# EAGLE design Frequency_synthesizer_v1.0 (EAGLE 7.2.0)
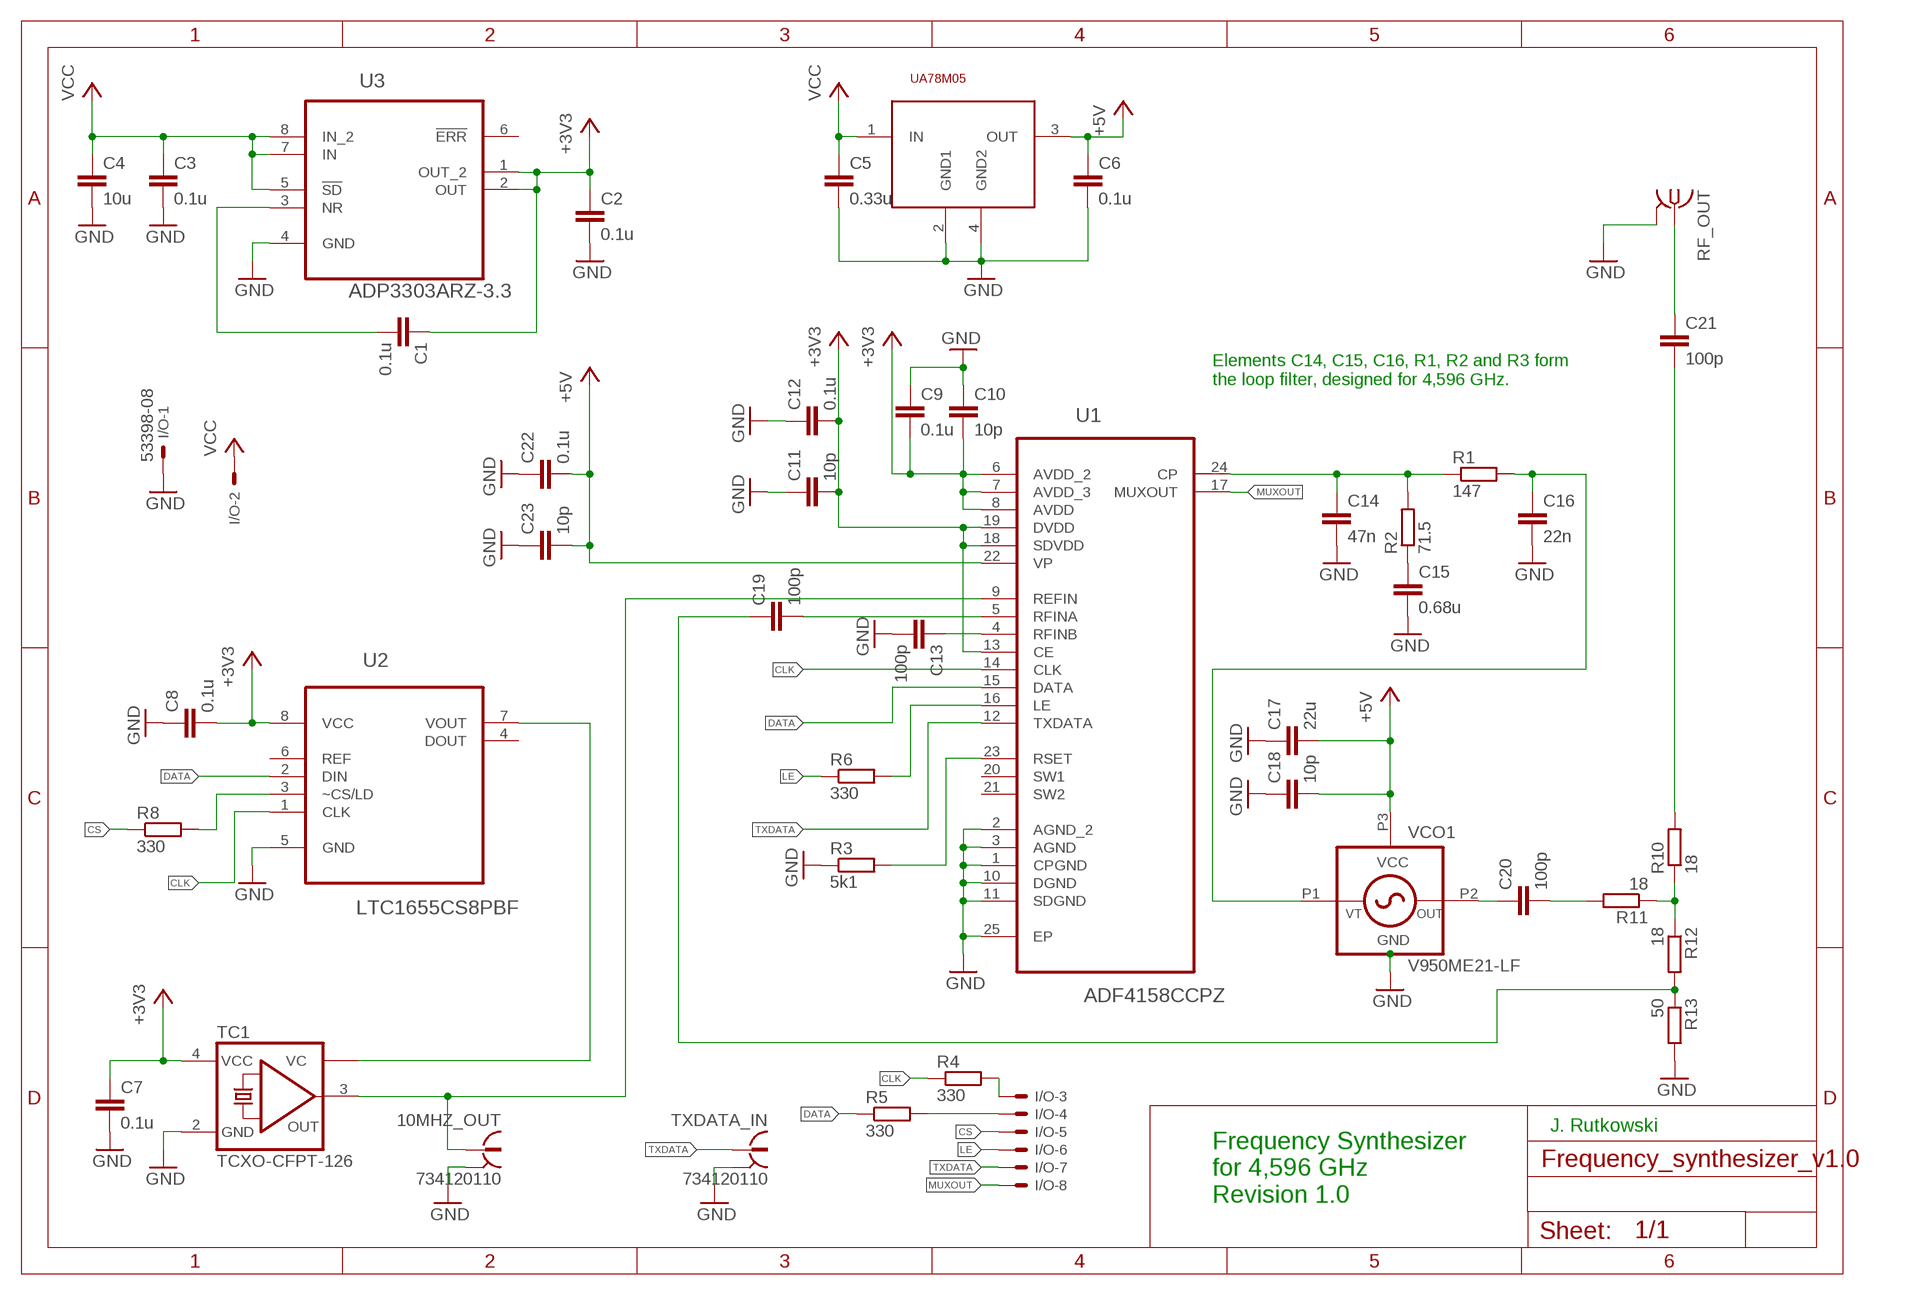
[diagram p0: schematic, sheet 1]

## Parts
10MHZ_OUT  734120110  [734120110]
C1  0.1u  C-EUC0603K  [C0603K]
C2  0.1u  C-EUC0603K  [C0603K]
C3  0.1u  C-EUC0603K  [C0603K]
C4  10u  C-EUC0805K  [C0805K]
C5  0.33u  C-EUC0603K  [C0603K]
C6  0.1u  C-EUC0603K  [C0603K]
C7  0.1u  C-EUC0603K  [C0603K]
C8  0.1u  C-EUC0603K  [C0603K]
C9  0.1u  C-EUC0603K  [C0603K]
C10  10p  C-EUC0603K  [C0603K]
C11  10p  C-EUC0603K  [C0603K]
C12  0.1u  C-EUC0603K  [C0603K]
C13  100p  C-EUC0402  [C0402]
C14  47n  C-EUC0603K  [C0603K]
C15  0.68u  C-EUC0603K  [C0603K]
C16  22n  C-EUC0603K  [C0603K]
C17  22u  C-EUC0805  [C0805]
C18  10p  C-EUC0603K  [C0603K]
C19  100p  C-EUC0402  [C0402]
C20  100p  C-EUC0402  [C0402]
C21  100p  C-EUC0402  [C0402]
C22  0.1u  C-EUC0603K  [C0603K]
C23  10p  C-EUC0603K  [C0603K]
I/O  53398-08  [53398-08]
R1  147  R-EU_R0603  [R0603]
R2  71.5  R-EU_R0603  [R0603]
R3  5k1  R-EU_R0603  [R0603]
R4  330  R-EU_R0603  [R0603]
R5  330  R-EU_R0603  [R0603]
R6  330  R-EU_R0603  [R0603]
R8  330  R-EU_R0603  [R0603]
R10  18  R-EU_R0402  [R0402]
R11  18  R-EU_R0402  [R0402]
R12  18  R-EU_R0402  [R0402]
R13  50  R-EU_R0402  [R0402]
RF_OUT  SMA-142-0711-871/876  [J502-ND-142-0711-871/876]
TC1  TCXO-CFPT-126  [7.0X5.0-4-PAD]
TXDATA_IN  734120110  [734120110]
U1  ADF4158CCPZ  [QFN50P400X400X80-25N]
U2  LTC1655CS8PBF  [SOIC127P600X175-8N]
U3  ADP3303ARZ-3.3  [SOIC127P600X175-8N]
U$1  UA78M05  [SOT-223]
VCO1  V950ME21-LF  MINI-14S  [MINI-14S]

## Nets
+3V3: C1.1 C2.1 C7.1 C8.2 C9.2 C10.2 C11.2 C12.2 TC1.4(VCC) U1.6(AVDD_2) U1.7(AVDD_3) U1.8(AVDD) U1.13(CE) U1.18(SDVDD) U1.19(DVDD) U2.8(VCC) U3.1(OUT_2) U3.2(OUT)
+5V: C6.1 C17.2 C18.2 C22.2 C23.2 U1.22(VP) U$1.3(OUT) VCO1.P3(VCC)
CLK: R4.1 U1.14(CLK) U2.1(CLK)
CS: I/O.5 R8.1
DATA: R5.1 U1.15(DATA) U2.2(DIN)
GND: 10MHZ_OUT.S@1 10MHZ_OUT.S@2 10MHZ_OUT.S@3 C2.2 C3.2 C4.2 C5.2 C6.2 C7.2 C8.1 C9.1 C10.1 C11.1 C12.1 C13.2 C14.2 C15.2 C16.2 C17.1 C18.1 C22.1 C23.1 I/O.1 R3.1 R13.2 RF_OUT.G@1 RF_OUT.G@2 RF_OUT.G@3 RF_OUT.G@4 TC1.2(GND) TXDATA_IN.S@1 TXDATA_IN.S@2 TXDATA_IN.S@3 U1.1(CPGND) U1.2(AGND_2) U1.3(AGND) U1.10(DGND) U1.11(SDGND) U1.25(EP) U2.5(GND) U3.4(GND) U$1.2(GND1) U$1.4(GND2) VCO1.S1 VCO1.S2 VCO1.S3 VCO1.S4 VCO1.S5 VCO1.S6 VCO1.S7 VCO1.S8 VCO1.S9 VCO1.S10 VCO1.S11
LE: I/O.6 R6.1
MUXOUT: I/O.8 U1.17(MUXOUT)
N$1: C14.1 R1.1 R2.2 U1.24(CP)
N$2: C16.1 R1.2 VCO1.P1(VT)
N$3: C1.2 U3.3(NR)
N$4: C15.1 R2.1
N$5: C13.1 U1.4(RFINB)
N$6: R8.2 U2.3(~CS/LD)
N$7: I/O.4 R5.2
N$8: I/O.3 R4.2
N$9: 10MHZ_OUT.1 TC1.3(OUT) U1.9(REFIN)
N$10: TC1.1(VC) U2.7(VOUT)
N$13: R6.2 U1.16(LE)
N$14: R3.2 U1.23(RSET)
N$15: C20.1 VCO1.P2(OUT)
N$16: C20.2 R11.2
N$17: R10.1 R11.1 R12.1
N$18: C19.1 R12.2 R13.1
N$19: C21.2 R10.2
N$20: C21.1 RF_OUT.1
N$21: C19.2 U1.5(RFINA)
TXDATA: I/O.7 TXDATA_IN.1 U1.12(TXDATA)
VCC: C3.1 C4.1 C5.1 I/O.2 U3.5(!SD) U3.7(IN) U3.8(IN_2) U$1.1(IN)
Unconnected: U1.20(SW1) U1.21(SW2) U2.4(DOUT) U2.6(REF) U3.6(!ERR)

## Notes on the sheet
- Elements C14, C15, C16, R1, R2 and R3 form
  the loop filter, designed for 4,596 GHz.
- J. Rutkowski
- Frequency Synthesizer
  for 4,596 GHz
  Revision 1.0

## Library data of the parts
10MHZ_OUT TXDATA_IN = con-coax:734120110: MICRO COAXIAL CONNECTOR RECEPTACLE VERTICAL Source: Data sheet <http://www.molex.com/pdm_docs/sd/734120110_sd.pdf>
C1-C23 = rcl:C-EU: CAPACITOR, European symbol
I/O = con-molex:53?-08: CONNECTOR wire to board 1.25 mm (.049 inch) pitch header; OC_FARNELL: 1125371; OC_NEWARK: unknown
R1-R6 R8 R10-R13 = rcl:R-EU_: RESISTOR, European symbol
RF_OUT = con-coax:SMA-: SMA 50 Ohm End Launch Jack Receptacle - Round Contact Johnson Components Source: www.johnsoncomponents.com .. J502-ND.pdf; MF: JOHNSON COMPONENTS; MPN: 142-0711-871; OC_FARNELL: unknown; OC_NEWARK: 01C1639
TC1 = IQD-Frequency-Products:TCXO: CRYSTAL RESONATOR
U1 = AD_PLL:ADF4158CCPZ: Frequency Synthesizer; MPN: ADF4158CCPZ; OC_FARNELL: -; OC_NEWARK: 76R7557; PACKAGE: LFCSP-24; SUPPLIER: Analog Devices
U2 = LTC_By_element14_Batch_1:LTC1655CS8PBF: 16-Bit Rail-to-Rail Micropower DAC; MPN: LTC1655CS8#PBF; OC_FARNELL: 1663654; OC_NEWARK: 56M2907; PACKAGE: SOIC-8; SUPPLIER: Linear Technology
U3 = analog-devices:ADP3303ARZ-3.3: Linear Regulator; MPN: ADP3303ARZ-3.3; OC_FARNELL: 2305721; OC_NEWARK: 59K2583; PACKAGE: SOIC-8; SUPPLIER: ANALOG DEVICES
U$1 = Custom-parts:UA78M05
VCO1 = z-comm:MINI-14S: VCO

## Board
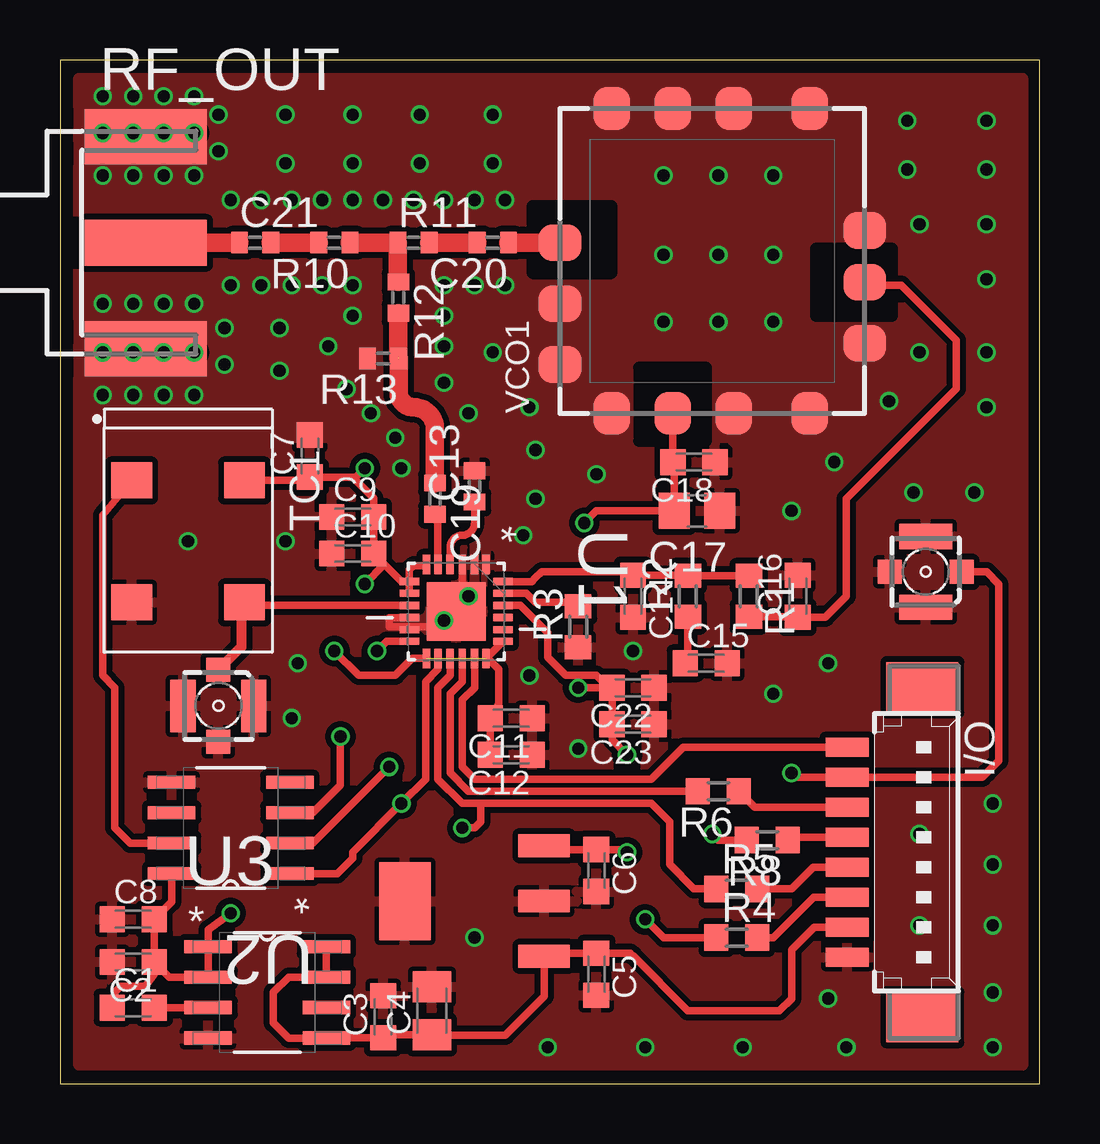
[diagram p1: board, top side]
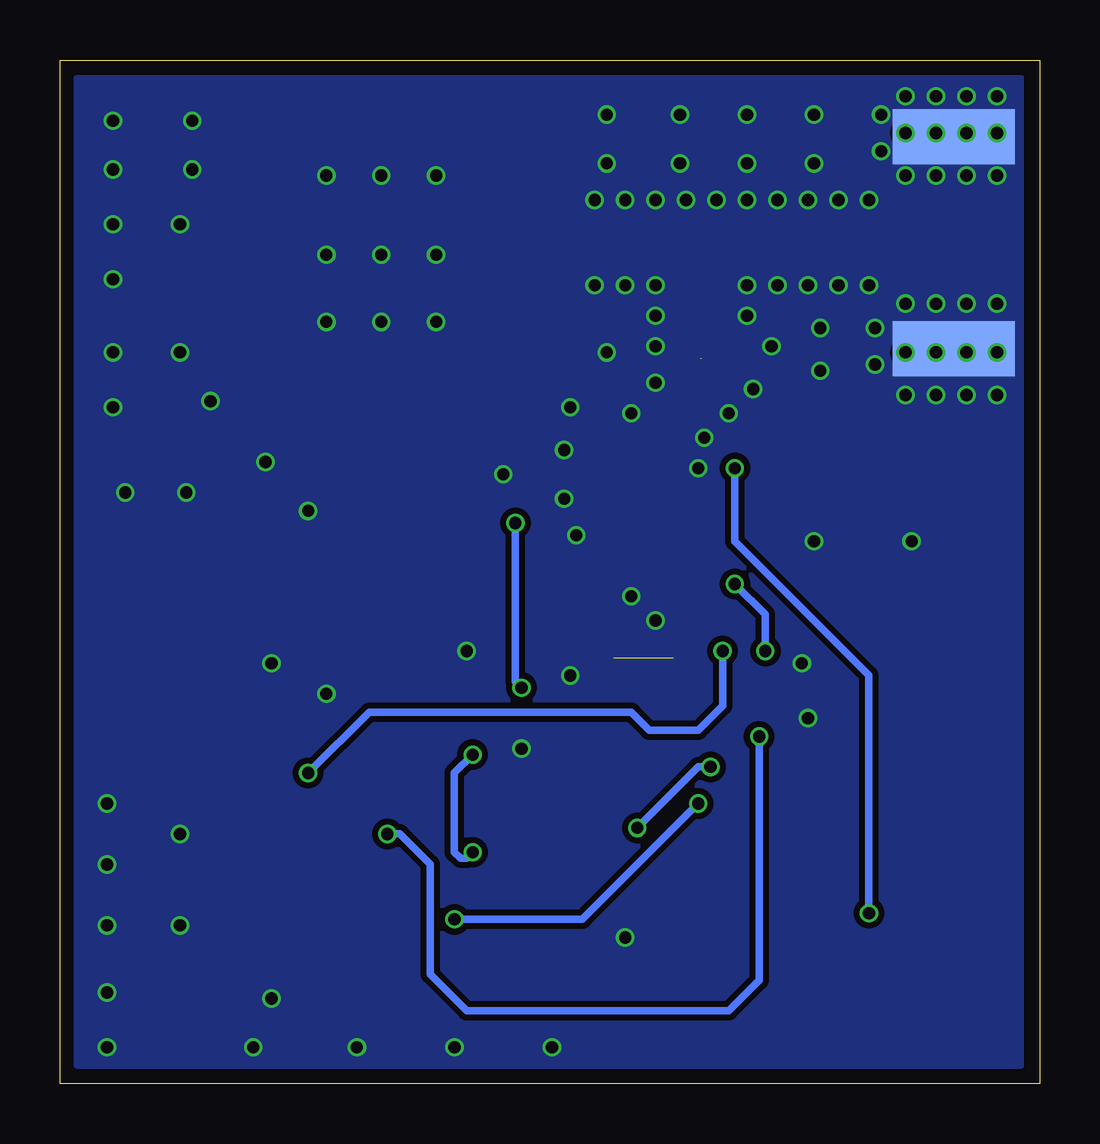
[diagram p2: board, bottom side, seen from below]

Size 40.82 x 42.66 mm. Coordinates in mm from the lower left corner, seen from the top.
Outline: 0,0 40.82,0 40.82,42.66 0,42.66 0,0
Copper layers (1*16): Top 0.018mm / dielectric 1.55mm / Bottom 0.018mm
Design rules "eC_2Layer_PClass6_BaseCopperO18_eCDefault *": minimum track width 0.15mm, minimum drill 0.35mm, track to track 0.15mm, track to pad 0.15mm, pad to pad 0.15mm, via to via 0.15mm, smd to smd 0mil, copper to edge 0.25mm, drill to drill 0.35mm, minimum pad ring 0.175mm, minimum via ring 0.125mm, stop-mask expansion 0mil, vias tented up to drill 0.45mm, thermal gap 0.2mm

### Footprints (pad centres in the part's own frame; a part is rotated, then mirrored left to right if it is on the bottom)
734120110 = smd 1 x 1: 1 0,-1.5; S@1 0,1.5 | smd 1.05 x 2.2: S@2 -1.475,0; S@3 1.475,0
C0603K = smd 1.05 x 1.08: 1 -0.875,0; 2 0.875,0
C0805K = smd 1.3 x 1.6: 1 -1,0; 2 1,0
C0402 = smd 0.7 x 0.9: 1 -0.65,0; 2 0.65,0
C0805 = smd 1.3 x 1.5: 1 -0.95,0; 2 0.95,0
53398-08 = smd 0.8 x 1.8: 1 4.375,-2.5; 2 3.125,-2.5; 3 1.875,-2.5; 4 0.625,-2.5; 5 -0.625,-2.5; 6 -1.875,-2.5; 7 -3.125,-2.5; 8 -4.375,-2.5 | smd 2.1 x 3: S1 6.875,0.625; S2 -6.875,0.625
R0603 = smd 1 x 1.1: 1 -0.85,0; 2 0.85,0
R0402 = smd 0.7 x 0.9: 1 -0.65,0; 2 0.65,0
J502-ND-142-0711-871/876 = smd 5.08 x 1.905: 1 2.565,0 | smd 5.08 x 2.286: G@1 2.565,4.42; G@2 2.565,-4.42 | smd 5.08 x 2.286 bottom: G@3 2.565,4.42; G@4 2.565,-4.42
7.0X5.0-4-PAD = smd 1.5 x 1.7: 1 -2.54,-2.35; 2 2.54,-2.35; 3 2.54,2.35; 4 -2.54,2.35
QFN50P400X400X80-25N = smd 0.813 x 0.305: 1 -1.956,1.245; 2 -1.956,0.762; 3 -1.956,0.254; 4 -1.956,-0.254; 5 -1.956,-0.762; 6 -1.956,-1.245; 13 1.956,-1.245; 14 1.956,-0.762; 15 1.956,-0.254; 16 1.956,0.254; 17 1.956,0.762; 18 1.956,1.245 | smd 0.305 x 0.813: 7 -1.245,-1.956; 8 -0.762,-1.956; 9 -0.254,-1.956; 10 0.254,-1.956; 11 0.762,-1.956; 12 1.245,-1.956; 19 1.245,1.956; 20 0.762,1.956; 21 0.254,1.956; 22 -0.254,1.956; 23 -0.762,1.956; 24 -1.245,1.956 | smd 2.438 x 2.438: 25 0,0
SOIC127P600X175-8N = smd 1.981 x 0.533: 1 -2.464,1.905; 2 -2.464,0.635; 3 -2.464,-0.635; 4 -2.464,-1.905; 5 2.464,-1.905; 6 2.464,-0.635; 7 2.464,0.635; 8 2.464,1.905
SOIC127P600X175-8N' = smd 1.981 x 0.559: 1 -2.464,1.905; 2 -2.464,0.635; 3 -2.464,-0.635; 4 -2.464,-1.905; 5 2.464,-1.905; 6 2.464,-0.635; 7 2.464,0.635; 8 2.464,1.905
SOT-223 = smd 0.95 x 2.15: 1 -2.3,-2.9; 2 0,-2.9; 3 2.3,-2.9 | smd 3.25 x 2.15: 4 0,2.9
MINI-14S = smd 1.524 x 1.778: P1 -0.889,-6.35; P2 0.762,6.35; S1 -3.429,-6.35; S2 1.27,-6.35; S7 -1.778,6.35; S8 -4.318,6.35 | smd 1.778 x 1.524: P3 -6.35,1.651; S3 6.35,-4.064; S4 6.35,-0.889; S5 6.35,1.651; S6 6.35,4.191; S9 -6.35,4.191; S10 -6.35,-0.889; S11 -6.35,-4.064

### Placement (x,y rotation side)
10MHZ_OUT  6.6,15.75 180 top
C1  3.05,3.17 0 top
C2  3.05,5.08 180 top
C3  13.46,2.79 90 top
C4  15.49,3.05 90 top
C5  22.35,4.57 270 top
C6  22.35,8.89 270 top
C7  10.41,26.16 90 top
C8  3.05,6.86 0 top
C9  12.19,23.62 0 top
C10  12.19,22.1 0 top
C11  18.8,15.24 180 top
C12  18.8,13.72 180 top
C13  17.27,24.89 90 top
C14  23.88,20.32 270 top
C15  26.92,17.53 0 top
C16  30.73,20.32 90 top
C17  26.54,23.88 180 top
C18  26.42,25.91 180 top
C19  15.62,24.38 270 top
C20  18.03,35.05 180 top
C21  8.13,35.05 0 top
C22  23.88,16.51 180 top
C23  23.88,14.99 180 top
I/O  35.31,9.65 270 top
R1  28.7,20.32 270 top
R2  26.16,20.32 90 top
R3  21.59,19.05 90 top
R4  28.19,6.1 0 top
R5  28.19,8.13 0 top
R6  27.43,12.19 180 top
R8  29.46,10.16 180 top
R10  11.43,35.05 180 top
R11  14.73,35.05 0 top
R12  14.1,32.77 270 top
R13  13.46,30.23 180 top
RF_OUT  1.02,35.05 0 top
TC1  5.33,22.61 270 top
TXDATA_IN  36.07,21.34 90 top
U1  16.51,19.68 270 top
U2  7.11,10.67 180 top
U3  ADP3303ARZ-3.3  [SOIC127P600X175-8N']  8.64,3.81 0 top
U$1  17.27,7.62 90 top
VCO1  27.18,34.29 90 top

### Tracks (layer width: path | path; a pad name or v marks a point on that pad's centre or on a via)
+3V3  (via drill 0.51)  (1 unrouted)
  Top 0.305: C2.1 4.56,4.45 U3.2 U3.1 6.17,6.43 v7.11,7.11 | C2.1 3.92,5.45 3.94,4.57 3.56,4.06 2.54,4.06 2.29,3.81 2.29,3.67 C1.1 | U1.19 U1.18 17.83,17.73 18.29,17.27 18.29,15.86 C11.2 C12.2 | U1.7 14.23,20.93 13.52,21.65 | 13.52,21.65 C10.2 C9.2 13.07,24.41 12.19,25.29 | U1.7 14.55,21.41 14.73,21.59 15.21,21.59 U1.6 | U1.8 U1.7 | TC1.4 10.27,25.15 C7.1 12.19,25.29 | C2.1 4.06,4.97 3.92,5.11 C8.2 4.65,7.58 U2.8 | 12.19,25.29 12.33,25.29 v12.7,25.65 | U1.13 14.68,17.73 13.97,17.02 12.45,17.02 v11.43,18.03 | 12.95,21.08 v12.7,20.83 13.52,21.65
  Bottom 0.305: v12.7,25.65 12.7,22.61 7.11,17.02 v7.11,7.11 | v11.43,18.03 11.43,19.56 v12.7,20.83
+5V  (via drill 0.51)
  Top 0.305: U1.22 19.18,19.94 19.3,19.81 20.32,18.8 20.32,17.78 21.08,17.02 22.35,17.02 22.86,16.51 C22.2 | C22.2 C23.2 23,14.34 v23.62,13.72 23.37,13.97 | U$1.3 20.33,9.77 C6.1 23.51,9.77 v23.62,9.65 | v21.84,23.37 22.35,23.88 C17.2 25.59,25.86 arc90 C18.2 25.54,27.93 arc90 VCO1.P3 | v21.59,16.51 C22.2
  Bottom 0.305: v23.62,9.65 23.88,9.4 24.13,9.4 24.38,9.65 24.38,12.95 v23.62,13.72 | v21.84,23.37 21.84,16.76 v21.59,16.51
CLK  (via drill 0.51)
  Top 0.305: R4.1 25.15,6.1 v24.38,6.86 | U1.14 15.75,17.27 15.24,16.76 15.24,12.7 v14.22,11.68 12.19,9.65 12.19,9.4 11.68,8.89 11.56,8.76 U2.1
  Bottom 0.305: v24.38,6.86 19.05,6.86 v14.22,11.68
CS
  Top 0.305: I/O.5 30.43,10.28 R8.1
DATA  (via drill 0.51)
  Top 0.305: U1.15 16.26,17.02 15.75,16.51 15.75,12.7 16.76,11.68 17.53,11.68 | R5.1 26.42,8.13 25.4,9.14 25.4,10.92 24.64,11.68 17.53,11.68 | v16.76,10.67 17.27,10.67 17.53,10.92 17.53,11.68 | U2.2 10.54,10.03 v13.72,13.21
  Bottom 0.305: v13.72,13.21 14.22,13.21 v16.76,10.67
GND  (via drill 0.51)
  Top 0.305: U1.3 16.76,19.94 U1.25 arc-90 15.88,19.05 14.73,19.05 13.72,19.05 13.72,19.3 13.72,19.43 U1.10
  other vias: 19.56,17.02 23.88,18.03 7.11,36.83 8.38,36.83 9.65,36.83 10.92,36.83 12.19,36.83 13.46,36.83 14.73,36.83 16,36.83 17.27,36.83 18.54,36.83 7.11,33.27 8.38,33.27 9.65,33.27 10.92,33.27 12.19,33.27 12.19,32 16,33.27 17.27,33.27 18.54,33.27 16,32 11.18,30.73 16,30.73 14.22,25.65 11.94,28.96 12.95,27.94 13.97,26.92 17.02,27.94 18.03,30.48 21.59,13.97 16,19.3 17.02,20.32 1.78,41.15 3.05,41.15 4.32,41.15 5.59,41.15 6.6,40.39 6.6,38.86 5.59,37.85 4.32,37.85 3.05,37.85 1.78,37.85 1.78,32.51 3.05,32.51 4.32,32.51 5.59,32.51 6.86,31.5 6.86,29.97 5.59,28.7 4.32,28.7 3.05,28.7 1.78,28.7 9.14,31.5 9.14,29.72 9.4,40.39 9.4,38.35 12.19,40.39 12.19,38.35 14.99,40.39 14.99,38.35 18.03,40.39 18.03,38.35 16,29.21 19.56,28.19 19.81,26.42 19.81,24.38 22.35,25.4 25.15,37.85 27.43,37.85 29.72,37.85 25.15,34.54 27.43,34.54 29.72,34.54 25.15,31.75 27.43,31.75 29.72,31.75 38.61,40.13 35.31,40.13 35.31,38.1 38.61,38.1 35.81,35.81 38.61,35.81 38.61,30.48 35.81,30.48 32.26,25.91 30.48,23.88 38.1,24.64 38.86,1.52 38.61,28.19 34.54,28.45 38.86,9.14 32,3.56 38.86,11.68 38.86,6.6 32,17.53 29.72,16.26 19.3,22.86 5.33,22.61 9.4,22.61 9.65,15.24 9.91,17.53 17.27,6.1 20.32,1.52 24.38,1.52 28.45,1.52 32.77,1.52 35.81,10.41 35.81,6.6 38.86,3.81 38.61,33.53 35.56,24.64
  pour Top (isolate 0.254): 0.76,41.91 40.13,41.91 40.13,0.76 0.76,0.76
  pour Bottom (isolate 0.254, no thermals): 0.76,41.91 40.13,41.91 40.13,0.76 0.76,0.76
  pour Top (isolate 0.254, no thermals): 40.13,41.91 0.76,41.91 0.76,26.92 40.13,26.92
LE
  Top 0.305: I/O.6 28.95,11.53 R6.1
MUXOUT
  Top 0.305: U1.17 17.27,16.51 16.76,16 16.76,13.21 17.27,12.7 24.64,12.7 25.96,14.03 I/O.8
N$1
  Top 0.305: U1.24 19.66,20.93 19.81,21.08 20.07,21.34 23.73,21.34 C14.1 26.14,21.2 R2.2 R1.1
N$2
  Top 0.305: R1.2 30.71,19.47 C16.1 31.89,19.45 32.77,20.32 32.77,24.38 37.34,28.96 37.34,30.99 35.05,33.27 33.66,33.27 VCO1.P1
N$3
  Top 0.305: U3.3 4.81,3.17 C1.2
N$4
  Top 0.305: R2.1 26.16,17.64 C15.1
N$5
  Top 0.305: U1.4 16.26,22.35 arc-90 16.76,22.86 arc90 17.27,23.37 C13.1
N$6  (via drill 0.51)
  Top 0.305: R8.2 27.43,10.16 v27.18,10.41 | U2.3 10.54,11.3 11.68,12.45 v11.68,14.48
  Bottom 0.305: v27.18,10.41 26.67,10.41 25.4,9.14 25.4,4.57 23.88,3.05 12.95,3.05 11.68,4.32 v11.68,14.48
N$7
  Top 0.305: R5.2 30.48,8.13 31.24,8.89 31.38,9.03 I/O.4
N$8
  Top 0.305: I/O.3 31.4,7.78 29.72,6.1 R4.2
N$9
  Top 0.305: U1.9 7.56,19.94 TC1.3
  Top 0.406: 7.56,19.94 7.56,18.2 10MHZ_OUT.1
N$10
  Top 0.305: U2.7 2.92,10.03 2.29,10.67 2.29,16.51 1.78,17.02 1.78,23.69 TC1.1
N$13
  Top 0.305: U1.16 16.76,16.76 16.26,16.26 16.26,12.95 17.02,12.19 R6.2
N$14
  Top 0.305: U1.23 19.43,20.45 19.81,20.07 21.42,20.07 R3.2
N$15
  Top 0.762: VCO1.P2 C20.1
N$16
  Top 0.762: C20.2 R11.2
N$17
  Top 0.762: R12.1 arc-90 14.08,33.43 R11.1 R10.1
N$18  (1 unrouted)
  Top 0.762: 14.1,30.24 R12.2 | R13.1 14.11,28.81 arc90 14.73,28.19 arc-90 15.62,27.3 C19.1
N$19
  Top 0.762: R10.2 C21.2
N$20
  Top 0.762: C21.1 RF_OUT.1
N$21
  Top 0.305: U1.5 15.75,23.35 C19.2
N$30  (via drill 0.51)
  other vias: 1.78,39.62
N$31  (via drill 0.51)
  other vias: 3.05,39.62
N$32  (via drill 0.51)
  other vias: 4.32,39.62
N$33  (via drill 0.51)
  other vias: 5.59,39.62
N$42  (via drill 0.51)
  other vias: 1.78,30.48
N$43  (via drill 0.51)
  other vias: 3.05,30.48
N$44  (via drill 0.51)
  other vias: 4.32,30.48
N$45  (via drill 0.51)
  other vias: 5.59,30.48
TXDATA  (via drill 0.51)
  Top 0.305: v30.48,12.95 30.66,12.78 I/O.7 36.24,12.78 38.43,12.78 38.61,12.95 39.12,13.46 39.12,20.83 38.61,21.34 TXDATA_IN.1 | U1.12 13.61,18.44 v13.21,18.03
  Bottom 0.305: v30.48,12.95 27.94,15.49 17.02,15.49 16.26,14.73 14.22,14.73 13.21,15.75 13.21,17.53 v13.21,18.03
VCC
  Top 0.305: I/O.2 31.42,6.53 30.48,5.59 30.48,5.08 30.48,3.56 29.97,3.05 26.16,3.05 23.88,5.33 23.76,5.45 C5.1 20.3,5.45 U$1.1 20.17,3.66 18.54,2.03 15.51,2.03 C4.1 14.1,2.05 C3.1 12.1,1.92 U3.5 9.53,1.91 8.89,2.54 8.89,3.05 8.89,3.81 9.53,4.45 U3.7 U3.8

### Text on the board
Top_leg: RF Out | VCO | C21 | R10 | R11 | C20 | R12 | Freq. Synth. / Rev. 1.0 / FEMTO-ST 2016 | C7 | TCXO | C19 | C18 | C13 | C17 | C9 | R1 | C16 | Trig | C10 | C14 | R2 | R3 | C15 | C22 | C11 | 8 | 10MHz | C23 | C12 | R6 | R8 | DAC | I/O | C6 | R5 | ADP | C3 | 78M05 | R4 | 1 | C4 | C5
Bottom_leg: Frequency synthesizer 0.5-6.1 GHz / Rev. 1.0 / FEMTO-ST 2016 | Digital I/O: / 1. GND / 2. VCC / 3. CLK / 4. DATA / 5. DAC CS / 6. ADF4158 LE / 7. TXData / 8. MUXOUT